# Altium project KeetV2.PrjPCB (part 5 of 6)
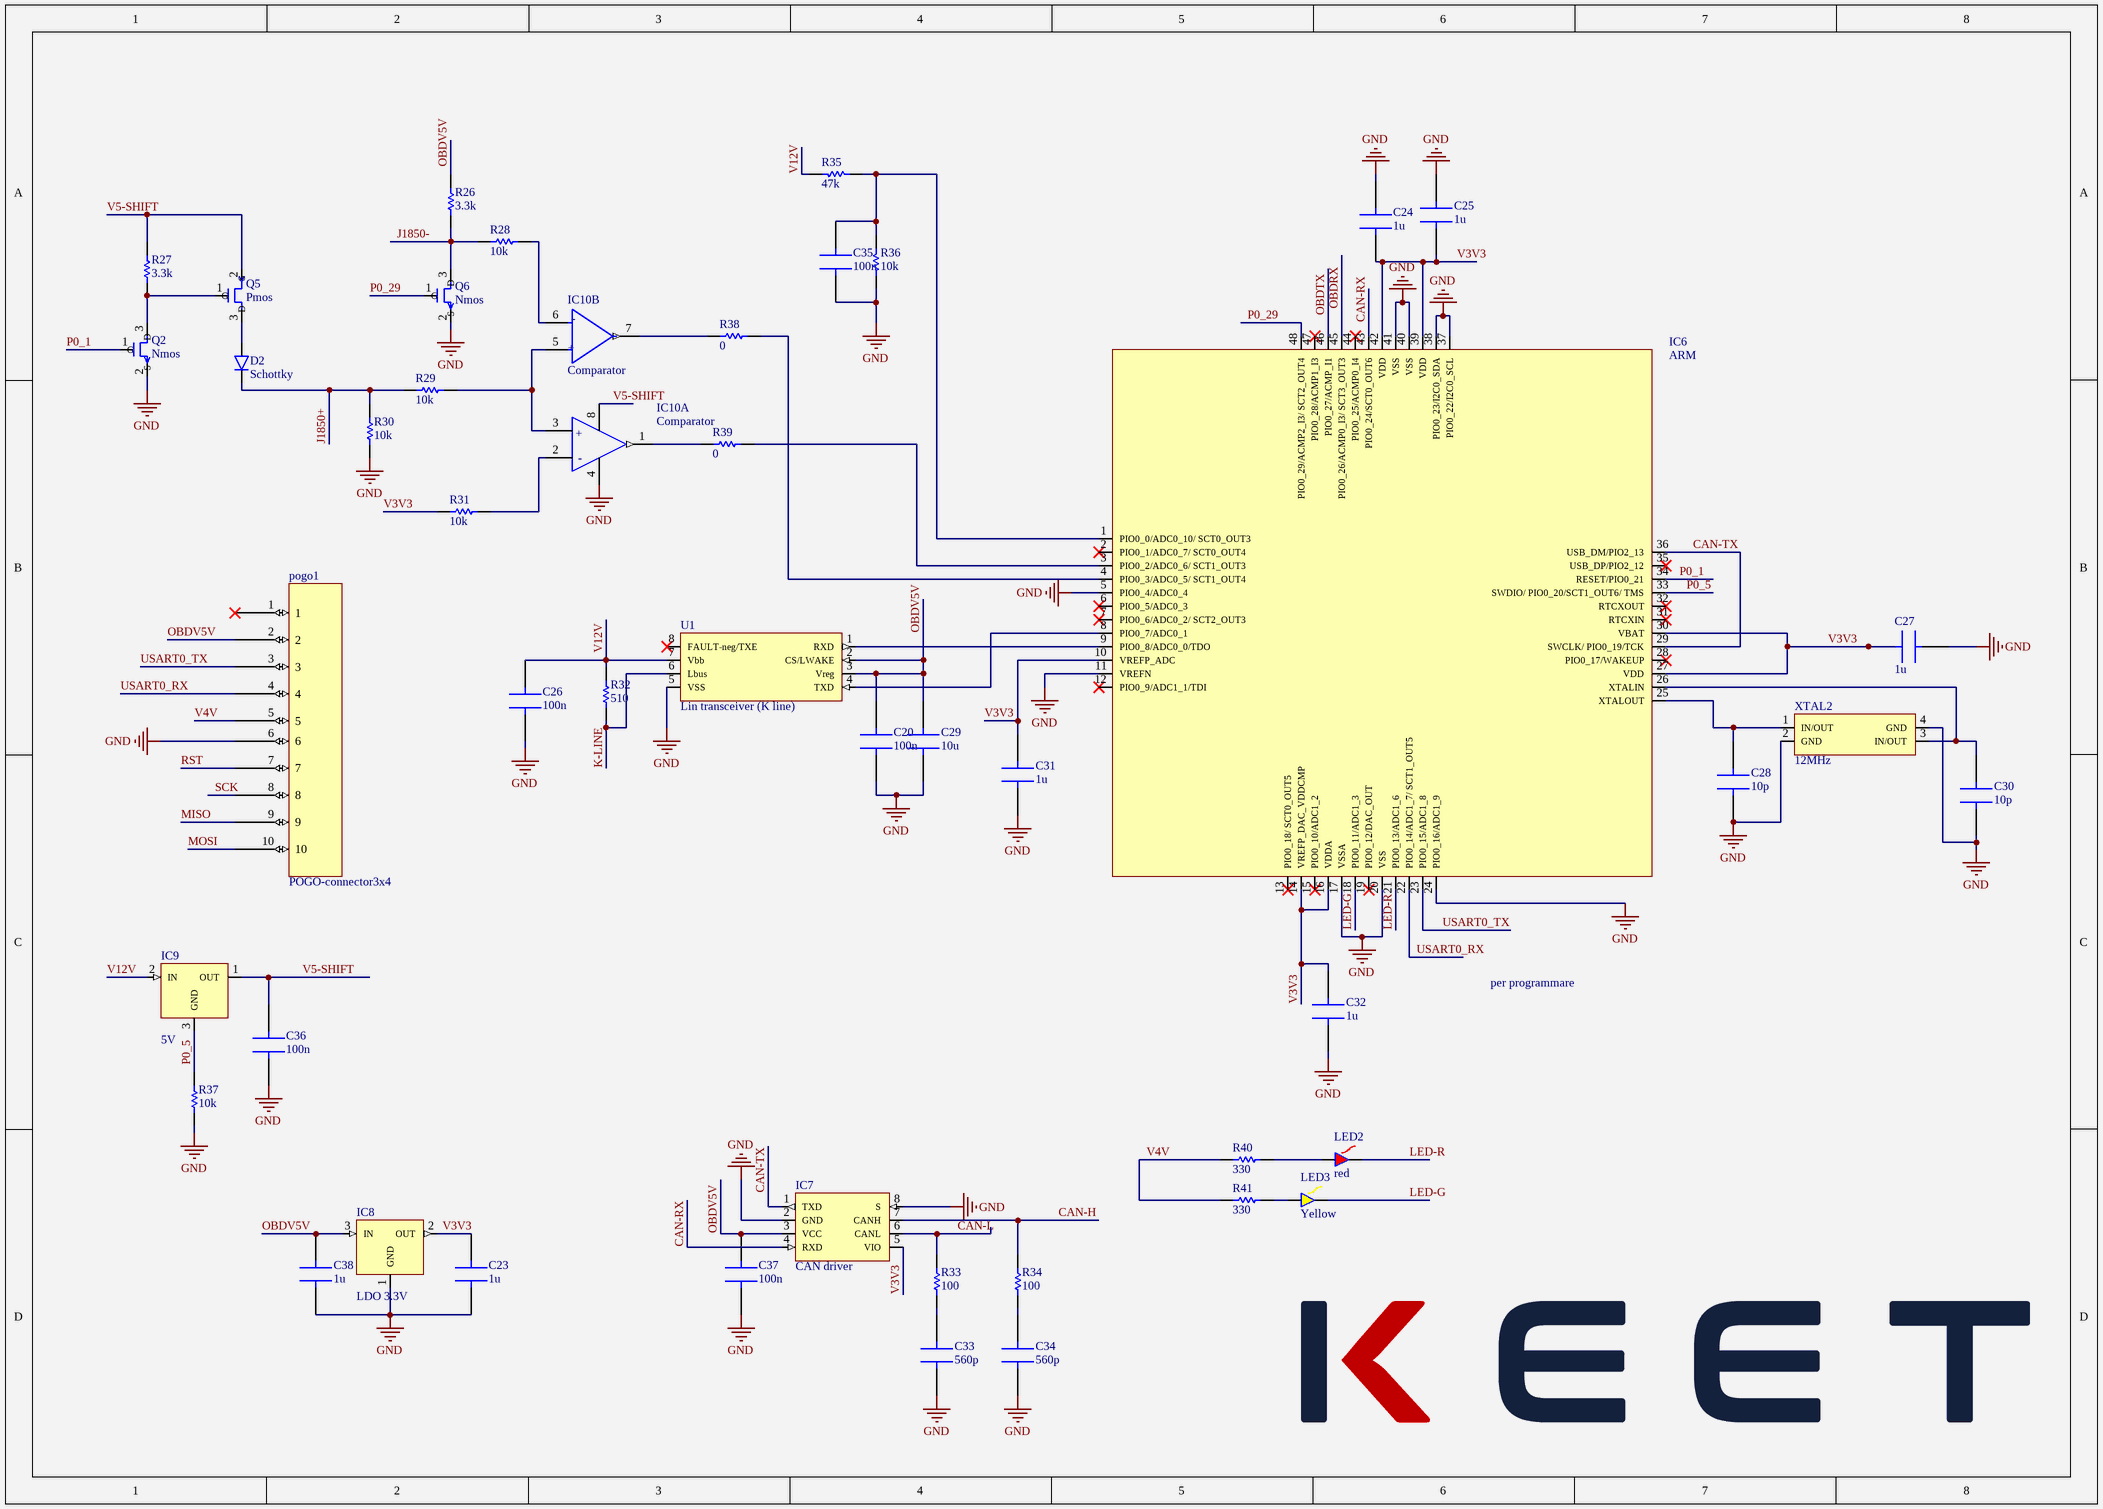
[diagram p6: OBD.SchDoc]

## Sheet OBD.SchDoc (continued)
### Library data of the parts
C20 C26 C37 = C1005X5R1H104K050BB: CAP CER 0.1UF 50V X5R 0402; Manufacturer: TDK; Dielectric Material: Ceramic; Capacitance: 100nF; Tolerance: 10%; Supplier 1: Mouser; Manufacturer Part Number: C1005X5R1H104K050BB; RoHS: Yes; Category: Ceramic Capacitors; Stock 1: 364267; Pricing 1: 1=0,12000, 10=0,04700, 50=0,04700, 100=0,03200, 1000=0,02200, 10000=0,01400 (USD); Mount: Surface Mount; Case/Package: 0402; Case Code (Metric): 1005; Case Code (Imperial): 0402; Weight: 2.3E-05oz; Min Operating Temperature: -55°C; Max Operating Temperature: 85°C; Dielectric: X5R; Voltage Rating: 50V; Packaging: Tape and Reel; Voltage Rating (DC): 50V; Termination: SMD/SMT; Package Quantity: 1; Resistor Type: Ceramic; Voltage: 50V; Series: C; Construction: Flat; Length: 1mm; Width: 0.02inch; Height: 0.5mm; Depth: 0.5mm; Thickness: 0.022inch; Radiation Hardening: No; Lead Free: Lead Free; REACH SVHC: No SVHC; RoHS Compliant: Yes; ComponentLink1URL: https://datasheet.ciiva.com/26946/getdatasheetpartid-743571-26946503.pdf?src-supplier=Verical; ComponentLink1Description: https://datasheet.ciiva.com/26946/getdatasheetpartid-743571-26946503.pdf?src-supplier=Verical; ComponentLink2URL: https://datasheet.ciiva.com/6292/tdkmlcccaprange-6292486.pdf?src-supplier=Digi-Key; ComponentLink2Description: https://datasheet.ciiva.com/6292/tdkmlcccaprange-6292486.pdf?src-supplier=Digi-Key; ComponentLink3URL: https://datasheet.ciiva.com/16494/e413-c-16494264.pdf?src-supplier=Future+Electronics; ComponentLink3Description: https://datasheet.ciiva.com/16494/e413-c-16494264.pdf?src-supplier=Future+Electronics; ComponentLink4URL: https://datasheet.ciiva.com/17487/e412-c-17487567.pdf?src-supplier=Avnet+Europe; ComponentLink4Description: https://datasheet.ciiva.com/17487/e412-c-17487567.pdf?src-supplier=Avnet+Europe; Supplier Part Number 1: 810-C1005X5R1H104K
C23-C25 C27 C31 C32 C38 = EMK105BJ105KVHF: TAIYO YUDEN - EMK105BJ105KVHF - CAPACITOR,CERAMIC,0402,16V,X5R,1 F, 10% ROHS COMPLIANT: YES; Capacitance: 1uF; Supplier 1: Mouser; Manufacturer: Taiyo Yuden; Manufacturer Part Number: EMK105BJ105KVHF; RoHS: Yes; Category: Ceramic Capacitors; Stock 1: 62407; Pricing 1: 1=0,10000, 10=0,06700, 50=0,06700, 100=0,02900, 1000=0,01500, 10000=0,01100 (USD); Mount: Surface Mount; Case/Package: 0402; Case Code (Metric): 1005; Case Code (Imperial): 0402; Weight: 2.3E-05oz; Min Operating Temperature: -55°C; Max Operating Temperature: 85°C; Voltage Rating: 16V; Package Quantity: 10000; Packaging: Tape and Reel; Tolerance: 10%; Dielectric: X5R; Termination: SMD/SMT; Voltage Rating (DC): 16V; Length: 0.039inch; Width: 0.5mm; Height: 0.5mm; Thickness: 0.022inch; Ratings: AEC-Q200; Lead Free: Lead Free; Halogen Free: Halogen Free; RoHS Compliant: Yes; ComponentLink1URL: http://www.mouser.com/ds/2/396/mlcc11_hq_e-541564.pdf?src-supplier=Mouser; ComponentLink1Description: http://www.mouser.com/ds/2/396/mlcc11_hq_e-541564.pdf?src-supplier=Mouser; ComponentLink2URL: http://www.yuden.co.jp/eu/product/category/capacitor/putpdf/EMK105BJ105KVHF.pdf?src-supplier=Avnet; ComponentLink2Description: http://www.yuden.co.jp/eu/product/category/capacitor/putpdf/EMK105BJ105KVHF.pdf?src-supplier=Avnet; ComponentLink3URL: https://www.yuden.co.jp/productdata/catalog/mlcc01_hq_e.pdf?src-supplier=Digi-Key; ComponentLink3Description: https://www.yuden.co.jp/productdata/catalog/mlcc01_hq_e.pdf?src-supplier=Digi-Key; ComponentLink4URL: http://ds.yuden.co.jp/TYCOMPAS/ut/detail.do?productNo=EMK105BJ105KVHF&fileName=EMK105BJ105KVHF_SS&mode=specSheetDownload&src-supplier=Digi-Key; ComponentLink4Description: http://ds.yuden.co.jp/TYCOMPAS/ut/detail.do?productNo=EMK105BJ105KVHF&fileName=EMK105BJ105KVHF_SS&mode=specSheetDownload&src-supplier=Digi-Key; ComponentLink5URL: http://www.farnell.com/datasheets/2819903.pdf?src-supplier=Newark; ComponentLink5Description: http://www.farnell.com/datasheets/2819903.pdf?src-supplier=Newark; Supplier Part Number 1: 963-EMK105BJ105KVHF
C28 C30 = 04025A100JAT2A: AVX - 04025A100JAT2A - SMD Multilayer Ceramic Capacitor, 10 pF, 50 V, 0402 [1005 Metric], ± 5%, C0G / NP0, AVX 0402 MLCC; Manufacturer: Kyocera AVX; Capacitance: 10pF; Voltage Rating (DC): 50V; Temperature Coefficient: 0ppm/°C; Supplier 1: Mouser; Manufacturer Part Number: 04025A100JAT2A; RoHS: Yes; Category: Ceramic Capacitors; Stock 1: 243212; Pricing 1: 1=0,08000, 10=0,01700, 50=0,01700, 100=0,01400, 1000=0,00800, 10000=0,00500 (USD); Mount: Surface Mount,PCB; Case/Package: 0402; Number of Pins: 2; Case Code (Imperial): 0402; Case Code (Metric): 1005; Contact Plating: Tin,Matte; Dielectric Material: Ceramic; Min Operating Temperature: -55°C; Max Operating Temperature: 125°C; Tolerance: 5%; Dielectric: C0G; Packaging: Tape and Reel; Voltage Rating: 50V; Package Quantity: 1; Termination: SMD/SMT; Voltage: 50V; Series: -; Construction: Flat; Length: 1mm; Width: 0.5mm; Height: 0.5mm; Depth: 0.5mm; Thickness: 0.022inch; Radiation Hardening: No; REACH SVHC: No SVHC; Lead Free: Lead Free; RoHS Compliant: Yes; ComponentLink1URL: https://datasheet.ciiva.com/150/ccog-150503.pdf?src-supplier=Digi-Key; ComponentLink1Description: https://datasheet.ciiva.com/150/ccog-150503.pdf?src-supplier=Digi-Key; ComponentLink2URL: https://datasheet.ciiva.com/150/ccog-150504.pdf?src-supplier=Digi-Key; ComponentLink2Description: https://datasheet.ciiva.com/150/ccog-150504.pdf?src-supplier=Digi-Key; ComponentLink3URL: https://datasheet.ciiva.com/2987/ccog-2987640.pdf?src-supplier=Avnet; ComponentLink3Description: https://datasheet.ciiva.com/2987/ccog-2987640.pdf?src-supplier=Avnet; ComponentLink4URL: https://datasheet.ciiva.com/150/ccog-150505.pdf?src-supplier=Digi-Key; ComponentLink4Description: https://datasheet.ciiva.com/150/ccog-150505.pdf?src-supplier=Digi-Key; ComponentLink5URL: https://datasheet.ciiva.com/16389/ccog-16389833.pdf?src-supplier=Future+Electronics; ComponentLink5Description: https://datasheet.ciiva.com/16389/ccog-16389833.pdf?src-supplier=Future+Electronics; ComponentLink6URL: https://datasheet.ciiva.com/7709/759117-7709531.pdf?src-supplier=Element14; ComponentLink6Description: https://datasheet.ciiva.com/7709/759117-7709531.pdf?src-supplier=Element14; ComponentLink7URL: https://datasheet.ciiva.com/7709/84496-7709756.pdf?src-supplier=Element14; ComponentLink7Description: https://datasheet.ciiva.com/7709/84496-7709756.pdf?src-supplier=Element14; ComponentLink8URL: https://datasheet.ciiva.com/16465/ccog-16465757.pdf?src-supplier=Avnet+Asia; ComponentLink8Description: https://datasheet.ciiva.com/16465/ccog-16465757.pdf?src-supplier=Avnet+Asia; ComponentLink9URL: https://datasheet.ciiva.com/1123/425357-1123470.pdf?src-supplier=Element14; ComponentLink9Description: https://datasheet.ciiva.com/1123/425357-1123470.pdf?src-supplier=Element14; ComponentLink10URL: https://datasheet.ciiva.com/1123/425357-1123471.pdf?src-supplier=Element14; ComponentLink10Description: https://datasheet.ciiva.com/1123/425357-1123471.pdf?src-supplier=Element14; Supplier Part Number 1: 581-04025A100J
C29 = GRM155R60J106ME05J: Multi-Layer Ceramic Capacitor 10uF X5R 20% 0402 Paper T/R; Manufacturer: Murata; Supplier 1: Mouser; Manufacturer Part Number: GRM155R60J106ME05J; RoHS: Yes; Category: Ceramic Capacitors; Pricing 1: 1=0,15000, 10=0,11100, 50=0,11100, 100=0,05200, 1000=0,03000, 10000=0,02100 (USD); Supplier Part Number 1: 81-GRM155R60J106ME05
C33 C34 = CC0402KRX7R9BB561: CAP CER 560PF 50V X7R 0402; Manufacturer: Yageo; Tolerance: 10%; Supplier 1: Mouser; Manufacturer Part Number: CC0402KRX7R9BB561; RoHS: Yes; Category: Ceramic Capacitors; Stock 1: 95508; Pricing 1: 1=0,10000, 10=0,02400, 50=0,02400, 100=0,01100, 1000=0,00900, 10000=0,00600 (USD); Mount: Surface Mount; Case/Package: 0402; Number of Pins: 2; Case Code (Metric): 1005; Case Code (Imperial): 0402; Min Operating Temperature: -55°C; Max Operating Temperature: 125°C; Capacitance: 560pF; Dielectric: X7R; Packaging: Tape and Reel; Package Quantity: 1; Voltage Rating: 50V; Voltage Rating (DC): 50V; Termination: SMD/SMT; Resistor Type: Ceramic; Series: CC; Construction: Flat; Length: 1mm; Width: 0.02inch; Height: 0.5mm; Thickness: 0.022inch; Depth: 0.5mm; Radiation Hardening: No; Lead Free: Lead Free; Halogen Free: Halogen Free; RoHS Compliant: Yes; ComponentLink1URL: https://datasheet.ciiva.com/155/mlccorderingcode-155860.pdf?src-supplier=Digi-Key; ComponentLink1Description: https://datasheet.ciiva.com/155/mlccorderingcode-155860.pdf?src-supplier=Digi-Key; ComponentLink2URL: https://datasheet.ciiva.com/155/mlccorderingcode-155861.pdf?src-supplier=Digi-Key; ComponentLink2Description: https://datasheet.ciiva.com/155/mlccorderingcode-155861.pdf?src-supplier=Digi-Key; ComponentLink3URL: https://datasheet.ciiva.com/155/mlccorderingcode-155862.pdf?src-supplier=Digi-Key; ComponentLink3Description: https://datasheet.ciiva.com/155/mlccorderingcode-155862.pdf?src-supplier=Digi-Key; ComponentLink4URL: https://datasheet.ciiva.com/17437/upy-gphc-x7r-6-3v-to-50v-8-17437195.pdf?src-supplier=Avnet+Europe; ComponentLink4Description: https://datasheet.ciiva.com/17437/upy-gphc-x7r-6-3v-to-50v-8-17437195.pdf?src-supplier=Avnet+Europe; ComponentLink5URL: https://datasheet.ciiva.com/11586/upy-gphc-x7r-6-3v-to-50v-8-11586492.pdf?src-supplier=Avnet; ComponentLink5Description: https://datasheet.ciiva.com/11586/upy-gphc-x7r-6-3v-to-50v-8-11586492.pdf?src-supplier=Avnet; ComponentLink6URL: https://datasheet.ciiva.com/13395/upy-gphc-x7r-6-3v-to-50v-8-13395197.pdf?src-supplier=Mouser; ComponentLink6Description: https://datasheet.ciiva.com/13395/upy-gphc-x7r-6-3v-to-50v-8-13395197.pdf?src-supplier=Mouser; Supplier Part Number 1: 603-CC402KRX7R9BB561
C35 C36 = GRM155R71C104KA88D: CAP CER 0.1UF 16V X7R 0402; Manufacturer: Murata; Material: Ceramic; Capacitance: 100nF; Tolerance: 10%; Insulation Resistance: 10GR; Supplier 1: Mouser; Manufacturer Part Number: GRM155R71C104KA88D; RoHS: Yes; Category: Ceramic Capacitors; Stock 1: 8059685; Pricing 1: 1=0,10000, 10=0,01200, 50=0,01200, 100=0,01000, 1000=0,00600, 10000=0,00300 (USD); Mount: Surface Mount; Case/Package: 0402; Number of Pins: 2; Case Code (Metric): 1005; Case Code (Imperial): 0402; Dielectric Material: Ceramic; Min Operating Temperature: -55°C; Max Operating Temperature: 125°C; Dielectric: X7R; Voltage Rating: 16V; Packaging: Tape and Reel; Voltage Rating (DC): 16V; Package Quantity: 1; Termination: SMD/SMT; Voltage: 16V; Length: 1mm; Width: 0.5mm; Height: 0.5mm; Thickness: 0.022inch; Depth: 0.5mm; Radiation Hardening: No; REACH SVHC: No SVHC; Lead Free: Lead Free; RoHS Compliant: Yes; ComponentLink1URL: https://datasheet.ciiva.com/18102/getdatasheetpartid-85307-18102905.pdf?src-supplier=Verical; ComponentLink1Description: https://datasheet.ciiva.com/18102/getdatasheetpartid-85307-18102905.pdf?src-supplier=Verical; ComponentLink2URL: https://datasheet.ciiva.com/129/grm155r71c104ka88-01-129739.pdf?src-supplier=Digi-Key; ComponentLink2Description: https://datasheet.ciiva.com/129/grm155r71c104ka88-01-129739.pdf?src-supplier=Digi-Key; ComponentLink3URL: https://datasheet.ciiva.com/129/grm155r71c104ka88-01-129740.pdf?src-supplier=Digi-Key; ComponentLink3Description: https://datasheet.ciiva.com/129/grm155r71c104ka88-01-129740.pdf?src-supplier=Digi-Key; ComponentLink4URL: https://datasheet.ciiva.com/29199/454098-da-01-en-vs-kondensator-0402-29199799.pdf?src-supplier=Conrad; ComponentLink4Description: https://datasheet.ciiva.com/29199/454098-da-01-en-vs-kondensator-0402-29199799.pdf?src-supplier=Conrad; ComponentLink5URL: https://datasheet.ciiva.com/28534/4360-28534133.pdf?src-supplier=Element14; ComponentLink5Description: https://datasheet.ciiva.com/28534/4360-28534133.pdf?src-supplier=Element14; ComponentLink6URL: https://datasheet.ciiva.com/14103/grmseries-highdielectrictype-eng-14103750.pdf?src-supplier=Distrelec; ComponentLink6Description: https://datasheet.ciiva.com/14103/grmseries-highdielectrictype-eng-14103750.pdf?src-supplier=Distrelec; ComponentLink7URL: https://datasheet.ciiva.com/16199/product-16199000.pdf?src-supplier=Future+Electronics; ComponentLink7Description: https://datasheet.ciiva.com/16199/product-16199000.pdf?src-supplier=Future+Electronics; ComponentLink8URL: https://datasheet.ciiva.com/14116/grmseries-highdielectrictype-eng-14116878.pdf?src-supplier=Distrelec; ComponentLink8Description: https://datasheet.ciiva.com/14116/grmseries-highdielectrictype-eng-14116878.pdf?src-supplier=Distrelec; ComponentLink9URL: https://datasheet.ciiva.com/7937/4360-7937615.pdf?src-supplier=Element14; ComponentLink9Description: https://datasheet.ciiva.com/7937/4360-7937615.pdf?src-supplier=Element14; ComponentLink10URL: https://datasheet.ciiva.com/28534/4360-28534127.pdf?src-supplier=Element14; ComponentLink10Description: https://datasheet.ciiva.com/28534/4360-28534127.pdf?src-supplier=Element14; Supplier Part Number 1: 81-GRM155R71C104KA88
D2 = BAT46W-7-F: Diode Schottky 100V 0.15A 2Pin SOD123; Manufacturer: Diodes; Forward Current: 150mA; Element Configuration: Single; Peak Non-Repetitive Surge Current: 750mA; Forward Voltage: 1V; Max Reverse Current: 2uA; Power Dissipation: 200mW; Supplier 1: Mouser; Manufacturer Part Number: BAT46W-7-F; RoHS: Yes; Category: Rectifier Diodes; Stock 1: 53638; Pricing 1: 1=0,370000, 10=0,245000, 50=0,245000, 100=0,133000, 1000=0,081000, 10000=0,056000 (USD); Number of Pins: 2; Weight: 0.000353oz; Contact Plating: Tin,Matte; Min Operating Temperature: -55°C; Max Operating Temperature: 125°C; Max Repetitive Reverse Voltage (Vrrm): 100V; Package Quantity: 3000; Packaging: Tape and Reel; Average Rectified Current: 150mA; Max Forward Surge Current (Ifsm): 750mA; Power Rating: 200mW; Max Reverse Voltage (DC): 100V; Series: -; Length: 2.85mm; Width: 1.7mm; Height: 1.25mm; Radiation Hardening: No; REACH SVHC: No SVHC; Lead Free: Lead Free; RoHS Compliant: Yes; ComponentLink1URL: https://datasheet.ciiva.com/4715/ds30044-73910-4715680.pdf?src-supplier=Mouser; ComponentLink1Description: https://datasheet.ciiva.com/4715/ds30044-73910-4715680.pdf?src-supplier=Mouser; ComponentLink2URL: https://datasheet.ciiva.com/8303/ds30044-8303137.pdf?src-supplier=Avnet; ComponentLink2Description: https://datasheet.ciiva.com/8303/ds30044-8303137.pdf?src-supplier=Avnet; ComponentLink3URL: https://datasheet.ciiva.com/6382/ds30044-6382981.pdf?src-supplier=Digi-Key; ComponentLink3Description: https://datasheet.ciiva.com/6382/ds30044-6382981.pdf?src-supplier=Digi-Key; ComponentLink4URL: https://datasheet.ciiva.com/16574/ds30044-16574286.pdf?src-supplier=Avnet+Europe; ComponentLink4Description: https://datasheet.ciiva.com/16574/ds30044-16574286.pdf?src-supplier=Avnet+Europe; ComponentLink5URL: https://datasheet.ciiva.com/16205/ds30044-16205030.pdf?src-supplier=Future+Electronics; ComponentLink5Description: https://datasheet.ciiva.com/16205/ds30044-16205030.pdf?src-supplier=Future+Electronics; ComponentLink6URL: https://datasheet.ciiva.com/22695/887886-22695798.pdf?src-supplier=Element14; ComponentLink6Description: https://datasheet.ciiva.com/22695/887886-22695798.pdf?src-supplier=Element14; ComponentLink7URL: https://datasheet.ciiva.com/6382/ds30044-6382983.pdf?src-supplier=Digi-Key; ComponentLink7Description: https://datasheet.ciiva.com/6382/ds30044-6382983.pdf?src-supplier=Digi-Key; ComponentLink8URL: https://datasheet.ciiva.com/6382/ds30044-6382985.pdf?src-supplier=Digi-Key; ComponentLink8Description: https://datasheet.ciiva.com/6382/ds30044-6382985.pdf?src-supplier=Digi-Key; ComponentLink9URL: https://datasheet.ciiva.com/15144/getdatasheetpartid-89219-15144635.pdf?src-supplier=Verical; ComponentLink9Description: https://datasheet.ciiva.com/15144/getdatasheetpartid-89219-15144635.pdf?src-supplier=Verical; ComponentLink10URL: https://datasheet.ciiva.com/1177/ds30044-1177855.pdf?src-supplier=Element14; ComponentLink10Description: https://datasheet.ciiva.com/1177/ds30044-1177855.pdf?src-supplier=Element14; Supplier Part Number 1: 621-BAT46W-7-F
IC6 = LPC1517JBD48E: IC MCU 32BIT 64KB FLASH 48LQFP; Manufacturer: NXP Semiconductors; RAM Size: 12KB; Max Power Dissipation: 1.5W; Interface: I2C,SPI,CAN,USART,UART; Number of I/Os: 32; Number of Timers/Counters: 4; Min Supply Voltage: 2.4V; Max Supply Voltage: 3.6V; Frequency: 72MHz; Oscillator Type: Internal; Data Bus Width: 32b; Watchdog Timer: Yes; Number of ADC Channels: 16; Peripherals: Brown-out Detect/Reset,POR,PWM,WDT,DMA; Operating Supply Voltage: 3.3V; Supplier 1: Mouser; Manufacturer Part Number: LPC1517JBD48E; RoHS: Yes; Category: Microcontrollers; Pricing 1: 1=5,33000, 10=4,52000, 50=4,52000, 100=3,72000, 1000=2,81000, 10000=2,81000 (USD); Mount: Surface Mount; Case/Package: LQFP; Number of Pins: 48; Weight: 6.287584oz; Min Operating Temperature: -40°C; Max Operating Temperature: 105°C; Package Quantity: 250; Packaging: Tray; Number of Programmable I/O: 32; Max Frequency: 72MHz; Memory Type: FLASH; Memory Size: 64KB; Core Architecture: ARM; Radiation Hardening: No; REACH SVHC: No SVHC; Lead Free: Lead Free; RoHS Compliant: Yes; ComponentLink1URL: https://datasheet.ciiva.com/29718/lpc15xx-29718830.pdf?src-supplier=Digi-Key; ComponentLink1Description: https://datasheet.ciiva.com/29718/lpc15xx-29718830.pdf?src-supplier=Digi-Key; Supplier Part Number 1: 771-LPC1517JBD48E
IC7 = TJF1051T/3,118: IC CAN TRANSEIVER HS 8SOIC; Manufacturer: NXP Semiconductors; Min Supply Voltage: 4.5V; Max Supply Voltage: 5.5V; Number of Transceivers: 1; Data Rate: 1Mbps; Nominal Supply Current: 70mA; Operating Supply Voltage: 5V; Simplex/Duplex: Half Duplex; Receiver Hysteresis: 120mV; Propagation Delay: 220ns; Supplier 1: Mouser; Manufacturer Part Number: TJF1051T/3,118; RoHS: Yes; Category: Interface ICs; Pricing 1: 1=1,03000, 10=0,87100, 50=0,87100, 100=0,59200, 1000=0,43600, 10000=0,41300 (USD); Mount: Surface Mount; Case/Package: SO; Number of Pins: 8; Min Operating Temperature: -40°C; Max Operating Temperature: 85°C; Packaging: Tape and Reel; Package Quantity: 2500; Supply Current: 70mA; Number of Transmitters: 1; Turn-On Delay Time: 220ns; Series: -; Radiation Hardening: No; RoHS Compliant: Yes; Lead Free: Lead Free; ComponentLink1URL: https://datasheet.ciiva.com/1767/tjf1051-1767282.pdf?src-supplier=Digi-Key; ComponentLink1Description: https://datasheet.ciiva.com/1767/tjf1051-1767282.pdf?src-supplier=Digi-Key; ComponentLink2URL: https://datasheet.ciiva.com/11212/tjf1051-11212991.pdf?src-supplier=Avnet; ComponentLink2Description: https://datasheet.ciiva.com/11212/tjf1051-11212991.pdf?src-supplier=Avnet; Supplier Part Number 1: 771-TJF1051T3118
IC8 = AP7313-33SRG-7: IC REG LIN 3.3V 150MA SOT23R-3; Manufacturer: Diodes; Max Power Dissipation: 600mW; Min Input Voltage: 2V; Number of Outputs: 1; Max Input Voltage: 6V; Polarity: Positive; Quiescent Current: 75uA; Accuracy: 2%; Output Type: Fixed; Dropout Voltage: 150mV; Min Current Limit: 200mA; Power Dissipation: 540W; Supplier 1: Mouser; Manufacturer Part Number: AP7313-33SRG-7; RoHS: Yes; Category: Voltage Regulators - Linear; Stock 1: 3794; Pricing 1: 1=0,35000, 10=0,26100, 50=0,26100, 100=0,13400, 1000=0,10000, 10000=0,10000 (USD); Mount: Surface Mount; Case/Package: TO-236-3; Number of Pins: 3; Weight: 0.000282oz; Min Operating Temperature: -40°C; Max Operating Temperature: 85°C; Output Voltage: 3.3V; Max Output Current: 150mA; Package Quantity: 3000; Packaging: Tape and Reel; Output Current: 150mA; Number of Regulators: 1; Min Output Voltage: 3.3V; Series: AP7313; Length: 3mm; Width: 1.4mm; Height: 1mm; Radiation Hardening: No; REACH SVHC: No SVHC; Lead Free: Lead Free; RoHS Compliant: Yes; ComponentLink1URL: https://datasheet.ciiva.com/26856/getdatasheetpartid-656981-26856375.pdf?src-supplier=Verical; ComponentLink1Description: https://datasheet.ciiva.com/26856/getdatasheetpartid-656981-26856375.pdf?src-supplier=Verical; ComponentLink2URL: https://datasheet.ciiva.com/16415/ap7313-16415567.pdf?src-supplier=Future+Electronics; ComponentLink2Description: https://datasheet.ciiva.com/16415/ap7313-16415567.pdf?src-supplier=Future+Electronics; Supplier Part Number 1: 621-AP7313-33SRG-7
IC9 = TLV76050DBZT: IC REG LINEAR 5V 100MA SOT23-3; Manufacturer: Texas Instruments; Output Type: Fixed; Output Configuration: Positive; Number of Regulators: 1; Max Input Voltage: 30V; Dropout Voltage: 1.1V; Quiescent Current: 5mA; Supplier 1: Mouser; Manufacturer Part Number: TLV76050DBZT; RoHS: Yes; Category: Voltage Regulators - Linear; Mount: Surface Mount; Case/Package: TO-236-3; Min Operating Temperature: -40°C; Max Operating Temperature: 125°C; Packaging: Tape and Reel; Min Output Voltage: 5V; Output Current: 100mA; RoHS Compliant: Yes; ComponentLink1URL: http://www.ti.com/general/docs/lit/getliterature.tsp?genericPartNumber=TLV760&fileType=pdf&src-supplier=Farnell; ComponentLink1Description: http://www.ti.com/general/docs/lit/getliterature.tsp?genericPartNumber=TLV760&fileType=pdf&src-supplier=Farnell; ComponentLink2URL: http://www.ti.com/lit/ds/symlink/tlv760.pdf?src-supplier=Digi-Key; ComponentLink2Description: http://www.ti.com/lit/ds/symlink/tlv760.pdf?src-supplier=Digi-Key; Supplier Part Number 1: 595-TLV76050DBZT
IC10 = LM393D: TEXAS INSTRUMENTS - LM393D - COMPARATOR DUAL, SMD, SOIC8, 393; Nominal Supply Current: 1mA; Max Supply Voltage: 36V; Min Supply Voltage: 2V; Voltage Gain: 106.02dB; Input Offset Voltage (Vos): 5mV; Number of Channels: 2; Min Dual Supply Voltage: 1V; Max Dual Supply Voltage: 18V; Output Current: 20mA; Quiescent Current: 2.5mA; Response Time: 0.3us; Input Bias Current: 250nA; Max Supply Current: 500uA; Output Current per Channel: 6mA; Output Type: TTL; Dual Supply Voltage: 9V; Operating Supply Voltage: 28V; Supplier 1: Mouser; Manufacturer: Texas Instruments; Manufacturer Part Number: LM393D; RoHS: Yes; Category: Amplifiers - Op Amps, Buffer, Instrumentation; Stock 1: 7555; Pricing 1: 1=0,44000, 10=0,32700, 50=0,32700, 100=0,18200, 1000=0,12500, 10000=0,11700 (USD); Mount: Surface Mount; Case/Package: SOIC; Number of Pins: 8; Weight: 0.002561oz; Contact Plating: Gold; Min Operating Temperature: 0°C; Max Operating Temperature: 70°C; Packaging: Rail/Tube; Package Quantity: 75; Number of Elements: 2; Length: 4.9mm; Width: 3.91mm; Height: 1.58mm; Radiation Hardening: No; Lead Free: Lead Free; RoHS Compliant: Yes; REACH SVHC: No SVHC; ComponentLink1URL: https://datasheet.ciiva.com/15131/getdatasheetpartid-248499-15131100.pdf?src-supplier=Verical; ComponentLink1Description: https://datasheet.ciiva.com/15131/getdatasheetpartid-248499-15131100.pdf?src-supplier=Verical; ComponentLink2URL: https://datasheet.ciiva.com/2970/lm2903-2970514.pdf?src-supplier=Avnet; ComponentLink2Description: https://datasheet.ciiva.com/2970/lm2903-2970514.pdf?src-supplier=Avnet; ComponentLink3URL: https://datasheet.ciiva.com/1827/lm193-1827528.pdf?src-supplier=Digi-Key; ComponentLink3Description: https://datasheet.ciiva.com/1827/lm193-1827528.pdf?src-supplier=Digi-Key; ComponentLink4URL: https://datasheet.ciiva.com/1483/1633629-1483065.pdf?src-supplier=Element14; ComponentLink4Description: https://datasheet.ciiva.com/1483/1633629-1483065.pdf?src-supplier=Element14; ComponentLink5URL: https://datasheet.ciiva.com/16464/lm2903-16464313.pdf?src-supplier=Avnet+Asia; ComponentLink5Description: https://datasheet.ciiva.com/16464/lm2903-16464313.pdf?src-supplier=Avnet+Asia; Supplier Part Number 1: 595-LM393D
LED2 = HSMS-C190: AVAGO TECHNOLOGIES - HSMS-C190 - LED, RED, 10MCD, 626NM; Manufacturer: Broadcom Avago; Lens Color: White; Forward Voltage: 2.1V; Viewing Angle: 170°; Lens Style: Diffused,Colorless,Rectangular; Forward Current: 20mA; Lens Transparency: Diffused; Power Dissipation: 52mW; Number of Elements: 1; Reverse Voltage: 5V; Supplier 1: Mouser; Manufacturer Part Number: HSMS-C190; RoHS: Yes; Category: LEDs; Stock 1: 51818; Pricing 1: 1=0,41000, 10=0,28800, 50=0,28800, 100=0,12800, 1000=0,09400, 10000=0,06400 (USD); Mount: Surface Mount; Case/Package: 0603; Number of Pins: 2; Color: Red; Case Code (Metric): 1608; Case Code (Imperial): 0603; Min Operating Temperature: -40°C; Max Operating Temperature: 85°C; Luminous Intensity: 10mcd; Packaging: Tape and Reel; Wavelength: 626nm; Dominant Wavelength: 626nm; Test Current: 20mA; Package Quantity: 4000; Illumination Color: Red; Power Rating: 52mW; Number of LEDs: 1; Series: -; Length: 1.6mm; Width: 0.8mm; Height: 0.8mm; Depth: 0.8mm; Radiation Hardening: No; REACH SVHC: No SVHC; Lead Free: Lead Free; RoHS Compliant: Yes; Supplier Part Number 1: 630-HSMS-C190
LED3 = HSMY-C190: LED, YELLOW, 8MCD, 586NM; LED Colour:Yellow; Bulb Size:-; Wavelength Typ:586nm; Forward Voltage:2.1V; Forward Current If:20mA; Luminous Intensity:8mcd; LED Mounting:SMD; Lens Shape:Rectangular; Viewing Angle:170 ; Packaging:Cut Tape;;RoHS Compliant: Yes; Manufacturer: Broadcom Avago; Lens Color: White; Number of Terminals/Pins: 2; Lens Style: Rectangular,Untinted,Diffused,Colorless; Forward Voltage: 2.1V; Viewing Angle: 170°; Forward Current: 20mA; Lens Transparency: Diffused; Power Dissipation: 52mW; Number of Elements: 1; Reverse Voltage: 5V; Supplier 1: Mouser; Manufacturer Part Number: HSMY-C190; RoHS: Yes; Category: LEDs; Stock 1: 44023; Pricing 1: 1=0,41000, 10=0,28800, 50=0,28800, 100=0,12800, 1000=0,09400, 10000=0,06400 (USD); Mount: Surface Mount; Case/Package: 0603; Number of Pins: 2; Color: Yellow; Case Code (Metric): 1608; Case Code (Imperial): 0603; Shape: Rectangular; Contact Plating: Gold; Min Operating Temperature: -40°C; Max Operating Temperature: 85°C; Luminous Intensity: 8mcd; Wavelength: 586nm; Packaging: Tape and Reel; Dominant Wavelength: 586nm; Test Current: 20mA; Package Quantity: 1; Illumination Color: Yellow; Power Rating: 52mW; Max Power Dissipation: 52mW; Number of LEDs: 1; Series: -; Length: 1.6mm; Width: 0.8mm; Height: 0.8mm; Depth: 0.8mm; Radiation Hardening: No; REACH SVHC: No SVHC; Lead Free: Lead Free; RoHS Compliant: Yes; ComponentLink1URL: https://datasheet.ciiva.com/34302/1557097-34302483.pdf?src-supplier=Jameco; ComponentLink1Description: https://datasheet.ciiva.com/34302/1557097-34302483.pdf?src-supplier=Jameco; ComponentLink2URL: https://datasheet.ciiva.com/15117/getdatasheetpartid-118294-15117593.pdf?src-supplier=Verical; ComponentLink2Description: https://datasheet.ciiva.com/15117/getdatasheetpartid-118294-15117593.pdf?src-supplier=Verical; ComponentLink3URL: https://datasheet.ciiva.com/11774/0900766b80ad69c9-11774266.pdf?src-supplier=RSComponents; ComponentLink3Description: https://datasheet.ciiva.com/11774/0900766b80ad69c9-11774266.pdf?src-supplier=RSComponents; ComponentLink4URL: https://datasheet.ciiva.com/29280/180660-da-01-en-chip-led-hsmy-c190-gelb-29280613.pdf?src-supplier=Conrad; ComponentLink4Description: https://datasheet.ciiva.com/29280/180660-da-01-en-chip-led-hsmy-c190-gelb-29280613.pdf?src-supplier=Conrad; ComponentLink5URL: https://datasheet.ciiva.com/14172/swseriehsmx-c150toc190-e-14172172.pdf?src-supplier=Distrelec; ComponentLink5Description: https://datasheet.ciiva.com/14172/swseriehsmx-c150toc190-e-14172172.pdf?src-supplier=Distrelec; Supplier Part Number 1: 630-HSMY-C190
pogo1 = POGO-connector3x4: pad layout for external pogo connector; System: Connector
Q2 Q6 = BSS138: Trans MOSFET N-CH 50V 0.22A 3-Pin SOT-23 T/R; Manufacturer: ON Semiconductor / Fairchild; Rds On Max: 3.5R; Continuous Drain Current (ID): 220mA; Max Power Dissipation: 360mW; Turn-Off Delay Time: 20ns; Gate to Source Voltage (Vgs): 20V; Input Capacitance: 27pF; Turn-On Delay Time: 2.5ns; Number of Elements: 1; Element Configuration: Single; Fall Time: 9ns; Threshold Voltage: 1.3V; On-State Resistance: 6R; Supplier 1: Mouser; Manufacturer Part Number: BSS138; RoHS: Yes; Category: MOSFETs; Stock 1: 226455; Pricing 1: 1=0,26000, 10=0,18000, 50=0,18000, 100=0,07300, 1000=0,05100, 10000=0,03300 (USD); Mount: Surface Mount; Case/Package: SOT-23; Number of Pins: 3; Contact Plating: Tin,Matte; Weight: 0.03g; Min Operating Temperature: -55°C; Max Operating Temperature: 150°C; Packaging: Tape and Reel; Drain to Source Voltage (Vdss): 50V; Power Dissipation: 360mW; Drain to Source Breakdown Voltage: 50V; Drain to Source Resistance: 3.5R; Package Quantity: 1; Rise Time: 9ns; Voltage Rating (DC): 50V; Current Rating: 220mA; Nominal Vgs: 1.3V; Termination: SMD/SMT; Dual Supply Voltage: 50V; Length: 2.92mm; Width: 1.3mm; Height: 0.93mm; Radiation Hardening: No; Lead Free: Lead Free; REACH SVHC: No SVHC; ComponentLink1URL: https://datasheet.ciiva.com/1190/193736-1190130.pdf?src-supplier=Element14; ComponentLink1Description: https://datasheet.ciiva.com/1190/193736-1190130.pdf?src-supplier=Element14; ComponentLink2URL: https://datasheet.ciiva.com/931/bss138-931776.pdf?src-supplier=Digi-Key; ComponentLink2Description: https://datasheet.ciiva.com/931/bss138-931776.pdf?src-supplier=Digi-Key; ComponentLink3URL: https://datasheet.ciiva.com/1190/193736-1190131.pdf?src-supplier=Element14; ComponentLink3Description: https://datasheet.ciiva.com/1190/193736-1190131.pdf?src-supplier=Element14; ComponentLink4URL: https://datasheet.ciiva.com/1254/193736-1254983.pdf?src-supplier=Newark; ComponentLink4Description: https://datasheet.ciiva.com/1254/193736-1254983.pdf?src-supplier=Newark; ComponentLink5URL: https://datasheet.ciiva.com/22655/193736-22655240.pdf?src-supplier=Element14; ComponentLink5Description: https://datasheet.ciiva.com/22655/193736-22655240.pdf?src-supplier=Element14; ComponentLink6URL: https://datasheet.ciiva.com/26229/bss138-26229007.pdf?src-supplier=Avnet+Europe; ComponentLink6Description: https://datasheet.ciiva.com/26229/bss138-26229007.pdf?src-supplier=Avnet+Europe; ComponentLink7URL: https://datasheet.ciiva.com/3304/bss138-3304424.pdf?src-supplier=Avnet; ComponentLink7Description: https://datasheet.ciiva.com/3304/bss138-3304424.pdf?src-supplier=Avnet; ComponentLink8URL: https://datasheet.ciiva.com/16834/bss138-16834843.pdf?src-supplier=Future+Electronics; ComponentLink8Description: https://datasheet.ciiva.com/16834/bss138-16834843.pdf?src-supplier=Future+Electronics; ComponentLink9URL: https://datasheet.ciiva.com/27050/784896-27050043.pdf?src-supplier=Jameco; ComponentLink9Description: https://datasheet.ciiva.com/27050/784896-27050043.pdf?src-supplier=Jameco; Supplier Part Number 1: 512-BSS138
Q5 = BSS84LT1G: On a Reel of 3000, P-Channel MOSFET, 130 mA, 50 V, 3-Pin SOT-23 ON Semiconductor BSS84LT1G; Rise Time: 1ns; Rds On Max: 10R; Input Capacitance: 30pF; Number of Elements: 1; Max Power Dissipation: 225mW; Drain to Source Voltage (Vdss): 50V; Continuous Drain Current (ID): 130mA; Turn-Off Delay Time: 16ns; Turn-On Delay Time: 3.6ns; Gate to Source Voltage (Vgs): 20V; Nominal Vgs: 2V; Threshold Voltage: -2V; Element Configuration: Single; Voltage Rating (DC): -50V; Current Rating: -130mA; Supplier 1: Mouser; Manufacturer: ON Semiconductor; Manufacturer Part Number: BSS84LT1G; RoHS: Yes; Category: MOSFETs; Stock 1: 957; Pricing 1: 1=0,290000, 10=0,195000, 50=0,195000, 100=0,080000, 1000=0,057000, 10000=0,036000 (USD); Case/Package: SOT-23-3; Number of Pins: 3; Contact Plating: Tin,Matte; Min Operating Temperature: -55°C; Max Operating Temperature: 150°C; Package Quantity: 1; Packaging: Tape and Reel; Fall Time: 1ns; Power Dissipation: 225mW; Drain to Source Breakdown Voltage: 50V; Drain to Source Resistance: 10R; On-State Resistance: 10R; Length: 0.119inch; Width: 0.055inch; Height: 0.04inch; Radiation Hardening: No; Lead Free: Lead Free; REACH SVHC: No SVHC; Halogen Free: Halogen Free; ComponentLink1URL: https://datasheet.ciiva.com/1190/86068-1190258.pdf?src-supplier=Element14; ComponentLink1Description: https://datasheet.ciiva.com/1190/86068-1190258.pdf?src-supplier=Element14; ComponentLink2URL: https://datasheet.ciiva.com/1255/1747989-1255091.pdf?src-supplier=Newark; ComponentLink2Description: https://datasheet.ciiva.com/1255/1747989-1255091.pdf?src-supplier=Newark; ComponentLink3URL: https://datasheet.ciiva.com/15198/getdatasheetpartid-86905-15198910.pdf?src-supplier=Verical; ComponentLink3Description: https://datasheet.ciiva.com/15198/getdatasheetpartid-86905-15198910.pdf?src-supplier=Verical; ComponentLink4URL: https://datasheet.ciiva.com/1190/86068-1190259.pdf?src-supplier=Element14; ComponentLink4Description: https://datasheet.ciiva.com/1190/86068-1190259.pdf?src-supplier=Element14; ComponentLink5URL: https://datasheet.ciiva.com/27054/1920992-27054773.pdf?src-supplier=Jameco; ComponentLink5Description: https://datasheet.ciiva.com/27054/1920992-27054773.pdf?src-supplier=Jameco; ComponentLink6URL: https://datasheet.ciiva.com/26146/bss84lt1-d-26146231.pdf?src-supplier=Avnet+Europe; ComponentLink6Description: https://datasheet.ciiva.com/26146/bss84lt1-d-26146231.pdf?src-supplier=Avnet+Europe; ComponentLink7URL: https://datasheet.ciiva.com/16335/bss84lt1-d-16335336.pdf?src-supplier=Future+Electronics; ComponentLink7Description: https://datasheet.ciiva.com/16335/bss84lt1-d-16335336.pdf?src-supplier=Future+Electronics; ComponentLink8URL: https://datasheet.ciiva.com/6380/bss84lt1-d-6380649.pdf?src-supplier=Digi-Key; ComponentLink8Description: https://datasheet.ciiva.com/6380/bss84lt1-d-6380649.pdf?src-supplier=Digi-Key; ComponentLink9URL: https://datasheet.ciiva.com/11168/bss84lt1-d-11168266.pdf?src-supplier=Avnet; ComponentLink9Description: https://datasheet.ciiva.com/11168/bss84lt1-d-11168266.pdf?src-supplier=Avnet; ComponentLink10URL: https://datasheet.ciiva.com/6380/bss84lt1-d-6380651.pdf?src-supplier=Digi-Key; ComponentLink10Description: https://datasheet.ciiva.com/6380/bss84lt1-d-6380651.pdf?src-supplier=Digi-Key; ComponentLink11URL: https://datasheet.ciiva.com/6380/bss84lt1-d-6380652.pdf?src-supplier=Digi-Key; ComponentLink11Description: https://datasheet.ciiva.com/6380/bss84lt1-d-6380652.pdf?src-supplier=Digi-Key; ComponentLink12URL: https://datasheet.ciiva.com/8115/bss84lt1-d-8115421.pdf?src-supplier=Avnet; ComponentLink12Description: https://datasheet.ciiva.com/8115/bss84lt1-d-8115421.pdf?src-supplier=Avnet; Supplier Part Number 1: 863-BSS84LT1G
R26 R27 = ERJ-2RKF3301X: PANASONIC - ERJ2RKF3301X - RES, 3K3, 1%, 0.1W, 0402, THICK FILM; Resistance: 3.3kR; Temperature Coefficient: 100ppm/°C; Power Rating: 100mW; Voltage Rating: 50V; Supplier 1: Mouser; Manufacturer: Panasonic; Manufacturer Part Number: ERJ-2RKF3301X; RoHS: Yes; Category: Chip SMD Resistors; Stock 1: 89476; Pricing 1: 1=0,10000, 10=0,02200, 50=0,02200, 100=0,00900, 1000=0,00400, 10000=0,00300 (USD); Mount: Surface Mount; Case/Package: 0402; Number of Pins: 2; Contact Plating: Tin; Case Code (Metric): 1005; Case Code (Imperial): 0402; Min Operating Temperature: -55°C; Max Operating Temperature: 155°C; Tolerance: 1%; Resistor Type: Thick Film; Packaging: Tape and Reel; Package Quantity: 1; Number of Terminations: 2; Termination: SMD/SMT; Max Power Dissipation: 100mW; Voltage Rating (DC): 50V; Features: Automotive AEC-Q200; Length: 1mm; Width: 0.02inch; Height: 0.35mm; Depth: 0.5mm; Radiation Hardening: No; REACH SVHC: No SVHC; Military Standard: Not; Lead Free: Lead Free; ComponentLink1URL: https://datasheet.ciiva.com/11821/0900766b80f80784-11821314.pdf?src-supplier=RSComponents; ComponentLink1Description: https://datasheet.ciiva.com/11821/0900766b80f80784-11821314.pdf?src-supplier=RSComponents; ComponentLink2URL: https://datasheet.ciiva.com/22687/1678782-22687445.pdf?src-supplier=Element14; ComponentLink2Description: https://datasheet.ciiva.com/22687/1678782-22687445.pdf?src-supplier=Element14; ComponentLink3URL: https://datasheet.ciiva.com/7802/aoa0000ce2-7802408.pdf?src-supplier=Element14; ComponentLink3Description: https://datasheet.ciiva.com/7802/aoa0000ce2-7802408.pdf?src-supplier=Element14; ComponentLink4URL: https://datasheet.ciiva.com/16777/70260748-16777945.pdf?src-supplier=Allied+Electronics; ComponentLink4Description: https://datasheet.ciiva.com/16777/70260748-16777945.pdf?src-supplier=Allied+Electronics; ComponentLink5URL: https://datasheet.ciiva.com/46372/1678782-46372730.pdf?src-supplier=Element14; ComponentLink5Description: https://datasheet.ciiva.com/46372/1678782-46372730.pdf?src-supplier=Element14; ComponentLink6URL: https://datasheet.ciiva.com/22667/1678782-22667883.pdf?src-supplier=Element14; ComponentLink6Description: https://datasheet.ciiva.com/22667/1678782-22667883.pdf?src-supplier=Element14; ComponentLink7URL: https://datasheet.ciiva.com/46372/1678782-46372731.pdf?src-supplier=Element14; ComponentLink7Description: https://datasheet.ciiva.com/46372/1678782-46372731.pdf?src-supplier=Element14; ComponentLink8URL: https://datasheet.ciiva.com/6138/aoa0000ce2-6138172.pdf?src-supplier=Farnell; ComponentLink8Description: https://datasheet.ciiva.com/6138/aoa0000ce2-6138172.pdf?src-supplier=Farnell; ComponentLink9URL: https://datasheet.ciiva.com/16773/70260748-16773756.pdf?src-supplier=Allied+Electronics; ComponentLink9Description: https://datasheet.ciiva.com/16773/70260748-16773756.pdf?src-supplier=Allied+Electronics; ComponentLink10URL: https://datasheet.ciiva.com/43467/1678782-43467358.pdf?src-supplier=Farnell; ComponentLink10Description: https://datasheet.ciiva.com/43467/1678782-43467358.pdf?src-supplier=Farnell; ComponentLink11URL: https://datasheet.ciiva.com/17213/aoa0000ce2-17213727.pdf?src-supplier=Avnet+Europe; ComponentLink11Description: https://datasheet.ciiva.com/17213/aoa0000ce2-17213727.pdf?src-supplier=Avnet+Europe; ComponentLink12URL: https://datasheet.ciiva.com/30264/aoa0000ce2-30264303.pdf?src-supplier=Onlinecomponents.com; ComponentLink12Description: https://datasheet.ciiva.com/30264/aoa0000ce2-30264303.pdf?src-supplier=Onlinecomponents.com; Supplier Part Number 1: 667-ERJ-2RKF3301X
R28-R31 R36 = ERJ-U02F1002X: RES, THICK FILM, 10K, 1%, 0.1W, 0402, REEL; Product Range:AEC-Q200 ERJ Series; Resistance:10kohm; Power Rating:100mW; Resistance Tolerance: 1%; Voltage Rating:50V; Resistor Case Style:0402 [1005 Metric]; Packaging:Tape & Reel; MSL:-;RoHS Compliant: Yes; Manufacturer: Panasonic; Resistance: 10kR; Power Rating: 100mW; Temperature Coefficient: 200ppm/°C; Voltage Rating: 50V; Current Rating: 1A; Supplier 1: Mouser; Manufacturer Part Number: ERJ-U02F1002X; RoHS: Yes; Category: Chip SMD Resistors; Stock 1: 30000; Pricing 1: 1=0,10000, 10=0,05100, 50=0,05100, 100=0,02900, 1000=0,01600, 10000=0,01200 (USD); Mount: Surface Mount; Case/Package: 0402; Case Code (Imperial): 0402; Case Code (Metric): 1005; Weight: 2.8E-05oz; Min Operating Temperature: -55°C; Max Operating Temperature: 155°C; Packaging: Tape and Reel; Tolerance: 1%; Resistor Type: Thick Film; Termination: SMD/SMT; Package Quantity: 10000; Voltage Rating (DC): 50V; Length: 1mm; Width: 0.5mm; Height: 0.35mm; Radiation Hardening: No; RoHS Compliant: Yes; REACH SVHC: Unknown; ComponentLink1URL: https://datasheet.ciiva.com/29928/aoa0000ce5-29928150.pdf?src-supplier=Avnet; ComponentLink1Description: https://datasheet.ciiva.com/29928/aoa0000ce5-29928150.pdf?src-supplier=Avnet; ComponentLink2URL: https://datasheet.ciiva.com/28514/1783557-28514361.pdf?src-supplier=Element14; ComponentLink2Description: https://datasheet.ciiva.com/28514/1783557-28514361.pdf?src-supplier=Element14; ComponentLink3URL: https://datasheet.ciiva.com/28514/1783557-28514367.pdf?src-supplier=Element14; ComponentLink3Description: https://datasheet.ciiva.com/28514/1783557-28514367.pdf?src-supplier=Element14; Supplier Part Number 1: 667-ERJ-U02F1002X
R32 = CRCW0402510RFKEDC: Res Thick Film 0402 510 Ohm 1% 0.063W(1/16W) ±100ppm/C Pad SMD T/R; Manufacturer: Vishay; Resistance: 510R; Max Power Dissipation: 250mW; Temperature Coefficient: 100ppm/°C; Zener Voltage: 75V; Impedance: 255R; Supplier 1: Mouser; Manufacturer Part Number: CRCW0402510RFKEDC; RoHS: Yes; Category: Chip SMD Resistors; Stock 1: 57461; Pricing 1: 1=0,10000, 10=0,03200, 50=0,03200, 100=0,01300, 1000=0,00500, 10000=0,00300 (USD); Mount: Surface Mount; Case/Package: 0402; Case Code (Imperial): 0402; Case Code (Metric): 1005; Min Operating Temperature: -55°C; Max Operating Temperature: 150°C; Resistor Type: Thick Film; Packaging: Cut Tape; Tolerance: 1%; Number of Terminations: 2; RoHS Compliant: Yes; ComponentLink1URL: http://www.vishay.com/docs/28773/crcwce3.pdf?src-supplier=Digi-Key; ComponentLink1Description: http://www.vishay.com/docs/28773/crcwce3.pdf?src-supplier=Digi-Key; Supplier Part Number 1: 71-CRCW0402510RFKEDC
R33 R34 = ERJ-2RHD1000X: RES SMD 100 OHM 0.5% 1/16W 0402; Manufacturer: Panasonic; Resistance: 100R; Temperature Coefficient: 50ppm/°C; Power Rating: 63mW; Voltage Rating: 50V; Supplier 1: Mouser; Manufacturer Part Number: ERJ-2RHD1000X; RoHS: Yes; Category: Chip SMD Resistors; Stock 1: 5726; Pricing 1: 1=0,10000, 10=0,09000, 50=0,09000, 100=0,03500, 1000=0,01600, 10000=0,01200 (USD); Mount: Surface Mount; Case/Package: 0402; Contact Plating: Tin; Case Code (Imperial): 0402; Case Code (Metric): 1005; Min Operating Temperature: -55°C; Max Operating Temperature: 125°C; Tolerance: 0.5%; Resistor Type: Thick Film; Packaging: Tape and Reel; Package Quantity: 10000; Termination: SMD/SMT; Voltage Rating (DC): 50V; Features: Automotive AEC-Q200; Series: ERJ; Max Power Dissipation: 63mW; Number of Terminations: 2; Technology: THICK FILM; Resistance Tolerance: 0.5%; Length: 1mm; Width: 0.5mm; Height: 0.35mm; Depth: 0.5mm; Radiation Hardening: No; REACH SVHC: No SVHC; RoHS Compliant: Yes; ComponentLink1URL: https://datasheet.ciiva.com/24071/aoa0000ce2-24071912.pdf?src-supplier=Mouser; ComponentLink1Description: https://datasheet.ciiva.com/24071/aoa0000ce2-24071912.pdf?src-supplier=Mouser; ComponentLink2URL: https://datasheet.ciiva.com/9119/aoa0000ce2-9119196.pdf?src-supplier=Avnet; ComponentLink2Description: https://datasheet.ciiva.com/9119/aoa0000ce2-9119196.pdf?src-supplier=Avnet; ComponentLink3URL: https://datasheet.ciiva.com/43511/aoa0000ce2-43511452.pdf?src-supplier=Onlinecomponents.com; ComponentLink3Description: https://datasheet.ciiva.com/43511/aoa0000ce2-43511452.pdf?src-supplier=Onlinecomponents.com; ComponentLink4URL: https://datasheet.ciiva.com/46438/1678782-46438252.pdf?src-supplier=Element14; ComponentLink4Description: https://datasheet.ciiva.com/46438/1678782-46438252.pdf?src-supplier=Element14; Supplier Part Number 1: 667-ERJ-2RHD1000X
R35 = CRCW040247K0FKED: Resistor;  Thick Film;  47 Kilohms;  0.063 W;  1%;  SMT;  0402;  TCR 37 ppm/DegC; Manufacturer: Vishay; Resistance: 47kR; Temperature Coefficient: 100ppm/°C; Power Rating: 63mW; Voltage Rating: 50V; Supplier 1: Mouser; Manufacturer Part Number: CRCW040247K0FKED; RoHS: Yes; Category: Chip SMD Resistors; Stock 1: 40176; Pricing 1: 1=0,10000, 10=0,03300, 50=0,03300, 100=0,01400, 1000=0,00500, 10000=0,00500 (USD); Mount: Surface Mount; Case/Package: 0402; Contact Plating: Tin; Weight: 2.3E-05oz; Case Code (Imperial): 0402; Case Code (Metric): 1005; Min Operating Temperature: -55°C; Max Operating Temperature: 155°C; Resistor Type: Thick Film; Tolerance: 1%; Termination: SMD/SMT; Packaging: Tape and Reel; Package Quantity: 10000; Number of Terminations: 2; Features: Automotive AEC-Q200; Series: CRCW; Max Power Dissipation: 63mW; Technology: THICK FILM; Construction: Rectangular; Voltage Rating (DC): 50V; Working Voltage: 50V; Resistance Tolerance: 1%; Length: 1mm; Width: 0.5mm; Height: 0.35mm; Depth: 0.5mm; Radiation Hardening: No; Lead Free: Lead Free; RoHS Compliant: Yes; Military Standard: Not; REACH SVHC: Unknown; ComponentLink1URL: https://datasheet.ciiva.com/11808/0900766b80d98824-11808993.pdf?src-supplier=RSComponents; ComponentLink1Description: https://datasheet.ciiva.com/11808/0900766b80d98824-11808993.pdf?src-supplier=RSComponents; ComponentLink2URL: https://datasheet.ciiva.com/5543/dcrcwe3-109170-5543015.pdf?src-supplier=Mouser; ComponentLink2Description: https://datasheet.ciiva.com/5543/dcrcwe3-109170-5543015.pdf?src-supplier=Mouser; ComponentLink3URL: https://datasheet.ciiva.com/16768/70201119-16768855.pdf?src-supplier=Allied+Electronics; ComponentLink3Description: https://datasheet.ciiva.com/16768/70201119-16768855.pdf?src-supplier=Allied+Electronics; ComponentLink4URL: https://datasheet.ciiva.com/7777/1720486-7777545.pdf?src-supplier=Element14; ComponentLink4Description: https://datasheet.ciiva.com/7777/1720486-7777545.pdf?src-supplier=Element14; ComponentLink5URL: https://datasheet.ciiva.com/3256/dcrcwe3-3256558.pdf?src-supplier=Avnet; ComponentLink5Description: https://datasheet.ciiva.com/3256/dcrcwe3-3256558.pdf?src-supplier=Avnet; ComponentLink6URL: https://datasheet.ciiva.com/3256/dcrcwe3-3256559.pdf?src-supplier=Avnet; ComponentLink6Description: https://datasheet.ciiva.com/3256/dcrcwe3-3256559.pdf?src-supplier=Avnet; ComponentLink7URL: https://datasheet.ciiva.com/7777/1697337-7777247.pdf?src-supplier=Element14; ComponentLink7Description: https://datasheet.ciiva.com/7777/1697337-7777247.pdf?src-supplier=Element14; Supplier Part Number 1: 71-CRCW0402-47K-E3
R37 = CRCW0402-10K0FKED: Res Thick Film 0402 10K Ohm 1% 1/16W ±100ppm/°C Molded SMD Paper T/R; Manufacturer: Vishay; Power Rating: 63mW; Resistance: 10kR; Voltage Rating: 50V; Supplier 1: Mouser; Manufacturer Part Number: CRCW0402-10K0FKED; RoHS: Yes; Category: Chip SMD Resistors; Stock 1: 1711719; Pricing 1: 1=0,100000, 10=0,033000, 50=0,033000, 100=0,014000, 1000=0,006000, 10000=0,005000 (USD); Mount: Surface Mount; Case/Package: 0402; Number of Pins: 2; Contact Plating: Tin; Weight: 2.3E-05oz; Case Code (Metric): 1005; Case Code (Imperial): 0402; Min Operating Temperature: -55°C; Max Operating Temperature: 155°C; Tolerance: 1%; Resistor Type: Thick Film; Temperature Coefficient: 100ppm/°C; Termination: SMD/SMT; Package Quantity: 10; Packaging: Tape and Reel; Number of Terminations: 2; Max Power Dissipation: 63mW; Voltage Rating (DC): 50V; Features: Automotive AEC-Q200; Length: 1mm; Width: 0.02inch; Height: 0.35mm; Depth: 0.5mm; Radiation Hardening: No; Lead Free: Lead Free; REACH SVHC: Unknown; Military Standard: Not; ComponentLink1URL: https://datasheet.ciiva.com/11809/0900766b80d98824-11809984.pdf?src-supplier=RSComponents; ComponentLink1Description: https://datasheet.ciiva.com/11809/0900766b80d98824-11809984.pdf?src-supplier=RSComponents; ComponentLink2URL: https://datasheet.ciiva.com/2463/dcrcwe3-2463025.pdf?src-supplier=Digi-Key; ComponentLink2Description: https://datasheet.ciiva.com/2463/dcrcwe3-2463025.pdf?src-supplier=Digi-Key; ComponentLink3URL: https://datasheet.ciiva.com/2463/dcrcwe3-2463026.pdf?src-supplier=Digi-Key; ComponentLink3Description: https://datasheet.ciiva.com/2463/dcrcwe3-2463026.pdf?src-supplier=Digi-Key; ComponentLink4URL: https://datasheet.ciiva.com/2463/dcrcwe3-2463027.pdf?src-supplier=Digi-Key; ComponentLink4Description: https://datasheet.ciiva.com/2463/dcrcwe3-2463027.pdf?src-supplier=Digi-Key; ComponentLink5URL: https://datasheet.ciiva.com/46385/1697337-46385560.pdf?src-supplier=Element14; ComponentLink5Description: https://datasheet.ciiva.com/46385/1697337-46385560.pdf?src-supplier=Element14; ComponentLink6URL: https://datasheet.ciiva.com/3255/dcrcwe3-3255961.pdf?src-supplier=Avnet; ComponentLink6Description: https://datasheet.ciiva.com/3255/dcrcwe3-3255961.pdf?src-supplier=Avnet; ComponentLink7URL: https://datasheet.ciiva.com/3255/dcrcwe3-3255962.pdf?src-supplier=Avnet; ComponentLink7Description: https://datasheet.ciiva.com/3255/dcrcwe3-3255962.pdf?src-supplier=Avnet; ComponentLink8URL: https://datasheet.ciiva.com/5547/dcrcwe3-109170-5547786.pdf?src-supplier=Mouser; ComponentLink8Description: https://datasheet.ciiva.com/5547/dcrcwe3-109170-5547786.pdf?src-supplier=Mouser; ComponentLink9URL: https://datasheet.ciiva.com/26316/fld-crcw-e3-data-en-26316618.pdf?src-supplier=Distrelec; ComponentLink9Description: https://datasheet.ciiva.com/26316/fld-crcw-e3-data-en-26316618.pdf?src-supplier=Distrelec; ComponentLink10URL: https://datasheet.ciiva.com/16208/dcrcwe3-16208525.pdf?src-supplier=Future+Electronics; ComponentLink10Description: https://datasheet.ciiva.com/16208/dcrcwe3-16208525.pdf?src-supplier=Future+Electronics; ComponentLink11URL: https://datasheet.ciiva.com/36856/1720486-36856909.pdf?src-supplier=Element14; ComponentLink11Description: https://datasheet.ciiva.com/36856/1720486-36856909.pdf?src-supplier=Element14; Supplier Part Number 1: 71-CRCW0402-10K-E3
R38 R39 = RC0805FR-070RL: Res Thick Film 0805 0 Ohm Epoxy Pad SMD T/R; Manufacturer: Yageo; Resistance: 0mR; Tolerance: 1%; Power Rating: 125mW; Supplier 1: Mouser; Manufacturer Part Number: RC0805FR-070RL; RoHS: Yes; Category: Chip SMD Resistors; Stock 1: 103802; Pricing 1: 1=0,10000, 10=0,03400, 50=0,03400, 100=0,01300, 1000=0,00700, 10000=0,00400 (USD); Case/Package: 0805; Contact Plating: Tin,Matte; Case Code (Imperial): 0805; Case Code (Metric): 2012; Size Code: 0805; Min Operating Temperature: -55°C; Max Operating Temperature: 155°C; Resistor Type: Thick Film; Packaging: Tape and Reel; Features: Moisture Resistant; Series: RC; Max Power Dissipation: 125mW; Number of Terminations: 2; Construction: Rectangular; Length: 2mm; Depth: 1.25mm; Radiation Hardening: No; Military Standard: Not; Lead Free: Lead Free; RoHS Compliant: Yes; ComponentLink1URL: https://datasheet.ciiva.com/17042/rc0805-17042698.pdf?src-supplier=Future+Electronics; ComponentLink1Description: https://datasheet.ciiva.com/17042/rc0805-17042698.pdf?src-supplier=Future+Electronics; ComponentLink2URL: https://datasheet.ciiva.com/15189/getdatasheetpartid-348154-15189885.pdf?src-supplier=Verical; ComponentLink2Description: https://datasheet.ciiva.com/15189/getdatasheetpartid-348154-15189885.pdf?src-supplier=Verical; Supplier Part Number 1: 603-RC0805FR-070RL